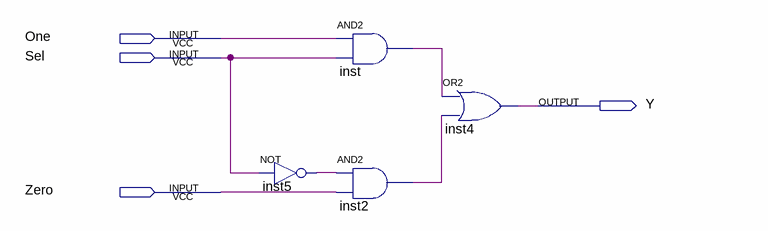
[diagram p0: schematic sheet]
// Quartus schematic Mux2-1.bdf as structural Verilog: 4 symbols, 4 pins
module \Mux2-1  (
  input  One,
  input  Sel,
  input  Zero,
  output Y
);

  wire inst2_out, inst5_out, inst_out;

  not inst5 (inst5_out, Sel);
  and inst (inst_out, One, Sel);
  and inst2 (inst2_out, inst5_out, Zero);
  or inst4 (Y, inst_out, inst2_out);
endmodule
